# Altium project TK516_LINREG-PSU.PrjPcb
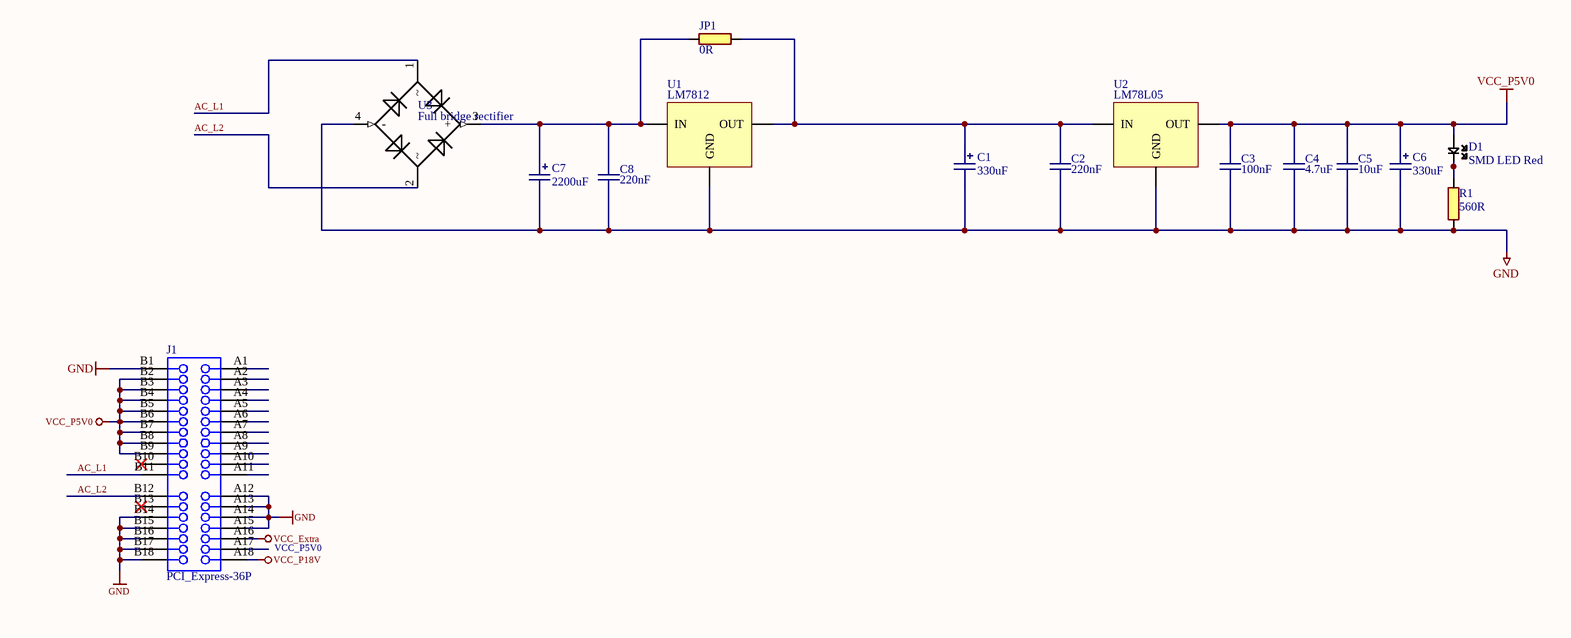
[diagram p0: TK516_LINREG-PSU.SchDoc]
1 sheet, 15 parts. Net scope: global (net labels, ports and power ports of the same name join across sheets).
Board file: TK516_LINREG-PSU.PcbDoc

## Sheet TK516_LINREG-PSU.SchDoc: TK516 LINREG-PSU
size A3; Organization: Omega Verksted; DocumentNumber: 10; Revision: 0; SheetNumber: 10; SheetTotal: 20

### Parts
C1  330uF  [CAPPR35D08H16]
C2  220nF  [CAPC0603(1608)55_N]
C3  100nF  [CAPC0603(1608)55_N]
C4  4.7uF  [CAPC0805(2012)100_N]
C5  10uF  [CAPC0805(2012)100_N]
C6  330uF  [CAPPR35D08H16]
C7  2200uF  [CAPPR35D08H16]
C8  220nF  [CAPC0603(1608)55_N]
D1  SMD LED Red  [I_LEDC0603(1608)_N]
J1  PCI_Express-36P  [PCIeX1-GF-2D-1000-1K-O36]
JP1  0R  [RESC0603(1608)_N]
R1  560R  [RESC0603(1608)_N]
U1  LM7812  [TO-220-3P]
U2  LM78L05  [TO-220-3P]
U3  Full bridge rectifier  [SOP500P1010X260-4N]

### Nets
2: U1.4 U2.4
GND: C1.1 C2.1 C3.1 C4.1 C5.1 C6.1 C7.1 C8.1 J1.A12 J1.A13 J1.A14 J1.A15 J1.B1 J1.B14 J1.B15 J1.B16 J1.B17 J1.B18 R1.1 U1.2(GND) U2.2(GND) U3.4(-)
VCC_Extra: J1.A16
VCC_P5V0: C3.2 C4.2 C5.2 C6.2 D1.1 J1.B2 J1.B3 J1.B4 J1.B5 J1.B6 J1.B7 J1.B8 J1.B9 U2.3(OUT)
VCC_P18V: J1.A18
AC_L1: J1.B11 U3.1
AC_L2: J1.B12 U3.2
NetC1_2: C1.2 C2.2 JP1.1 U1.3(OUT) U2.1(IN)
NetC7_2: C7.2 C8.2 JP1.2 U1.1(IN) U3.3(+)
NetD1_2: D1.2 R1.2

Not connected (* = marked no-connect by the designer): J1 A1 A2 A3 A4 A5 A6 A7 A8 A9 A10 A11 A17 B10* B13*

### Notes on the sheet
- (near J1) VCC_P5V0
- Size:
- Date:
- Title:
- A3
- Revision:
- Sheet
- of
- Author:
- File:

### Library data of the parts
C1 C6 = 3290: 25V elektrolytt; id: 3290; pakke_opprettet_av: 1335; symbol_opprettet_av: 815; leverandor_varenr: 2346202; pris: 0; produsent: Rubycon; leverandor: Farnell; pakketype: TH; komponenttype: 2; pakke_opprettet: 13/11/2016 14:32:40; symbol_opprettet: 28/06/2014 15:26:13; navn: 330uF
C2 C8 = 3316: X7R 25V 10%; id: 3316; pakke_opprettet_av: 815; pris: 0; nokkelord: kondensator; pakketype: 0603; komponenttype: 2; leverandor: Farnell; leverandor_varenr: 3013426; produsent: Samsung; pakke_opprettet: 18/02/2015 14:18:13; symbol_opprettet_av: 815; symbol_opprettet: 14/11/2014 20:19:34; navn: 220nF
C3 = 5152: X7R 50V 5%; id: 5152; pakke_opprettet_av: 815; leverandor_varenr: 1759122; pris: 1; nokkelord: Kondensator, Capacitor, CAP; produsent: Multicomp; leverandor: Farnell; pakketype: 0603; rad: 21; rom: OV; lager_type: Baklager; dybde: 0; antall: 1000; komponenttype: 2; pakke_opprettet: 18/02/2015 14:18:13; symbol_opprettet_av: 815; symbol_opprettet: 14/11/2014 20:19:34; navn: 100nF; hylle: 0
C4 = 4164: X5R 10V 10%; id: 4164; pakke_opprettet_av: 815; pris: 0; pakketype: 0805; komponenttype: 2; leverandor: Farnell; leverandor_varenr: 3013462; produsent: Samsung; pakke_opprettet: 14/11/2014 20:52:01; symbol_opprettet_av: 815; symbol_opprettet: 14/11/2014 20:19:34; navn: 4.7uF
C5 = 3114: X5R 6.3V 10%; id: 3114; pakke_opprettet_av: 815; leverandor_varenr: 2320852; pris: 0; leverandor: Farnell; pakketype: 0805; komponenttype: 2; pakke_opprettet: 14/11/2014 20:52:01; symbol_opprettet_av: 815; symbol_opprettet: 14/11/2014 20:19:34; navn: 10uF
C7 = 4844: 6.3V, Elektrolytt, 5mm lead spacing; pakketype: TH; id: 4844; rad: 9; rom: OV; lager_type: Fremlager; dybde: 5; hylle: 4; antall: 1; pakke_opprettet_av: 1335; symbol_opprettet_av: 815; nokkelord: Elektrolytt, kondensator, capacitor; komponenttype: 2; leverandor: Farnell; leverandor_varenr: 2627680; produsent: Multicomp; navn: 2200uF; pakke_opprettet: 13/11/2016 14:32:40; symbol_opprettet: 28/06/2014 15:26:13; pris: 1
D1 = 5143: SMD; id: 5143; rad: 0; rom: OV; lager_type: Fremlager; dybde: 2; hylle: 6; antall: 50; pakke_opprettet_av: 815; leverandor_varenr: 8554641; pris: 1; produsent: Avago; leverandor: Farnell; pakketype: 0603; komponenttype: 9; pakke_opprettet: 06/07/2014 18:55:44; symbol_opprettet_av: 815; symbol_opprettet: 06/07/2014 18:59:47; navn: SMD LED Red; nokkelord: SMD
J1 = 3037: PCI express PCB kortkankonnektor; id: 3037; pakke_opprettet_av: 815; pris: 0; komponenttype: 11; produsent: PCB feature; pakke_opprettet: 07/06/2015 17:49:10; symbol_opprettet_av: 815; symbol_opprettet: 06/07/2014 17:26:37; navn: PCIeX1-GF-2D-1000-1K-O36; pakketype: -
JP1 = 3646: 0.1W 1% Thick film resistor, Jumper; id: 3646; rad: -1; rom: OV; lager_type: Fremlager; dybde: 0; hylle: 2; antall: 450; pakke_opprettet_av: 815; leverandor_varenr: 2447060; nokkelord: smd, 0603, motstand; produsent: multicomp; leverandor: Farnell; pakketype: 0603; komponenttype: 1; navn: 0R; pakke_opprettet: 08/07/2014 21:15:30; symbol_opprettet_av: 815; symbol_opprettet: 08/07/2014 21:16:33; pris: 0
R1 = 5228: 0.1W 1% Thick film resistor; id: 5228; rad: 0; rom: OV; lager_type: Fremlager; dybde: 42; hylle: 2; antall: 60; pakke_opprettet_av: 815; pakketype: 0603; komponenttype: 1; leverandor: Farnell; leverandor_varenr: 2447397; produsent: Multicomp; pakke_opprettet: 08/07/2014 21:15:30; symbol_opprettet_av: 815; symbol_opprettet: 08/07/2014 21:16:33; navn: 560R; pris: 0
U1 = 4338: Voltage Regulator; rad: 0; rom: OV; hylle: 5; pakketype: TH; id: 4338; lager_type: Fremlager; pakke_opprettet_av: 815; leverandor_varenr: 1467365; pris: 25; produsent: Fairchild; leverandor: Farnell; komponenttype: 14; dybde: 0; antall: 0; navn: LM7812; pakke_opprettet: 09/06/2015 21:08:41; symbol_opprettet_av: 815; symbol_opprettet: 20/06/2015 13:45:33
U2 = 3342: Voltage Regulator; id: 3342; rad: 0; rom: OV; lager_type: Fremlager; dybde: 1; hylle: 5; antall: 100; pakke_opprettet_av: 815; pris: 4; pakketype: TH; komponenttype: 14; leverandor: Farnell; leverandor_varenr: 9666095; produsent: Onsemi; pakke_opprettet: 09/06/2015 21:08:41; symbol_opprettet_av: 815; symbol_opprettet: 20/06/2015 13:45:33; navn: LM78L05
U3 = 6202: Bridge Rectifier, Dual-In-Line, Single Phase, 1 kV, 2 A; id: 6202; pakke_opprettet_av: 815; leverandor_varenr: 3519283; navn: DBLS207G RDG; pris: 14; nokkelord: likeretter, bridge rectifier smd; produsent: Taiwan Semiconductor; leverandor: Farnell; pakketype: SMD; komponenttype: 9; pakke_opprettet: 21/10/2021 21:55:51; symbol_opprettet_av: 815; symbol_opprettet: 21/10/2021 22:00:55; farnell: 1299301